# Altium schematic sheet Controller.SchDoc
size A3
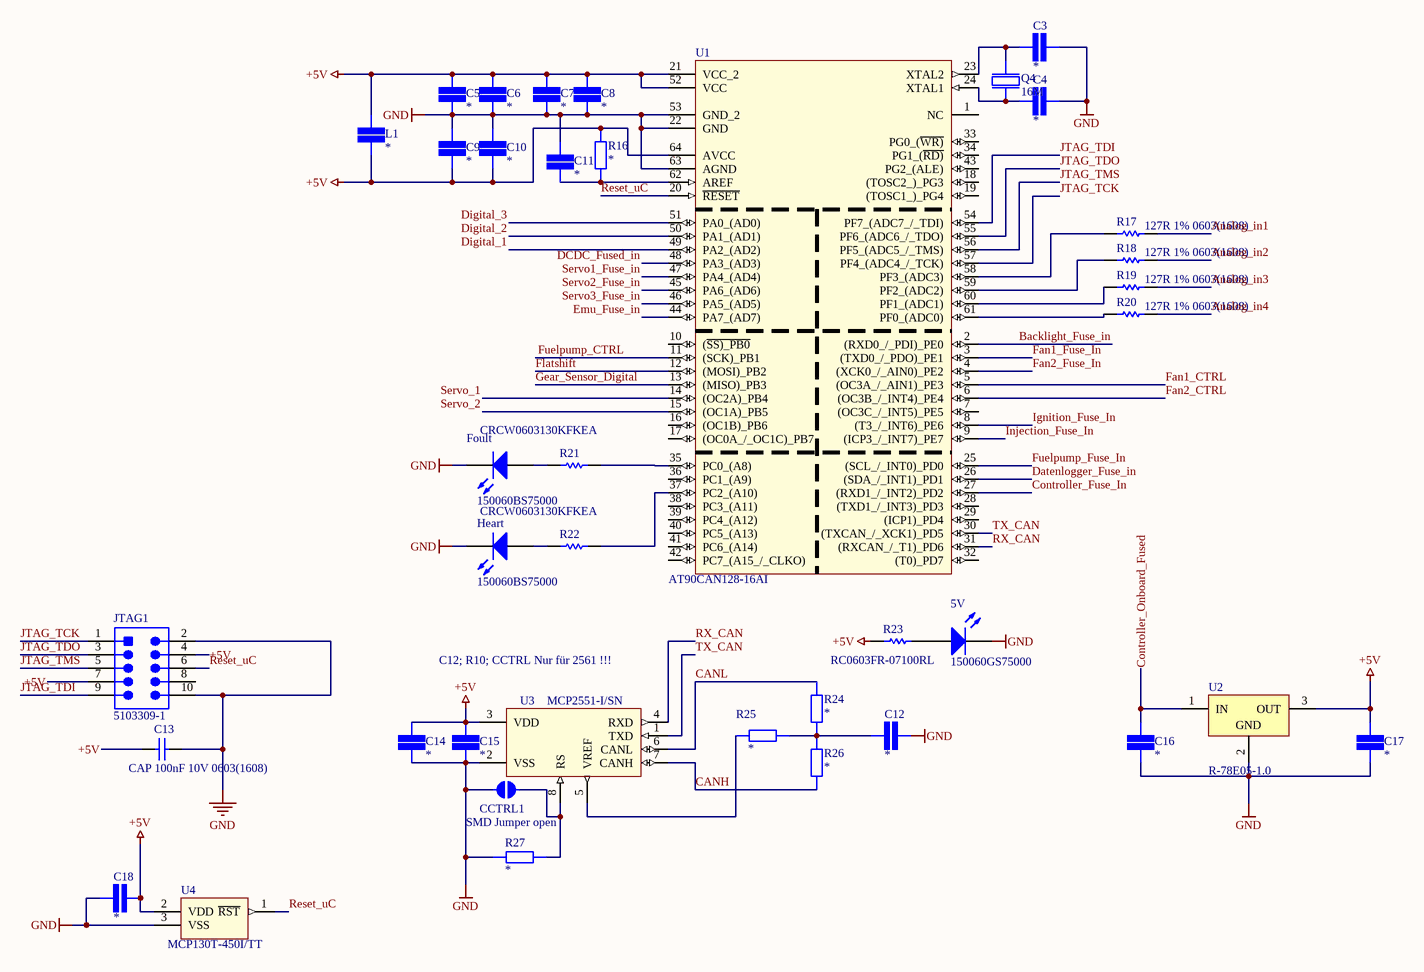
[diagram p0: Controller.SchDoc]

## Parts
5V  150060GS75000  [0603_A]
C3  SMD Capacitor  [CAP 0603/1608]  (value not drawn)
C4  SMD Capacitor  [CAP 0603/1608]  (value not drawn)
C5  SMD Capacitor  [CAP 0603/1608]  (value not drawn)
C6  SMD Capacitor  [CAP 0603/1608]  (value not drawn)
C7  SMD Capacitor  [CAP 0603/1608]  (value not drawn)
C8  SMD Capacitor  [CAP 0603/1608]  (value not drawn)
C9  SMD Capacitor  [CAP 0603/1608]  (value not drawn)
C10  SMD Capacitor  [CAP 0603/1608]  (value not drawn)
C11  SMD Capacitor  [CAP 0603/1608]  (value not drawn)
C12  SMD Capacitor  [CAP 0603/1608]  (value not drawn)
C13  CAP 100nF 10V 0603(1608)  [CAPC0603(1608)100_L]
C14  SMD Capacitor  [CAP 0603/1608]  (value not drawn)
C15  SMD Capacitor  [CAP 0603/1608]  (value not drawn)
C16  SMD Capacitor  [CAP 0603/1608]  (value not drawn)
C17  SMD Capacitor  [CAP 0603/1608]  (value not drawn)
C18  SMD Capacitor  [CAP 0603/1608]  (value not drawn)
CCTRL1  SMD Jumper open  [SMD-JUMPER-OPEN]  (no BOM)
Foult  150060BS75000  [0603_A]
Heart  150060BS75000  [0603_A]
JTAG1  5103309-1  [TECO-5103309-1_V]
L1  SMD Capacitor  [CAP 0603/1608]  (value not drawn)
Q4  16M  [NDK NX5032GA]
R16  SMD Resistor  [STACKPOLE CSR0603]  (value not drawn)
R17  127R 1% 0603(1608)  [RESC0603(1608)_N]
R18  127R 1% 0603(1608)  [RESC0603(1608)_N]
R19  127R 1% 0603(1608)  [RESC0603(1608)_N]
R20  127R 1% 0603(1608)  [RESC0603(1608)_N]
R21  CRCW0603130KFKEA  [RESC1609X50X30NL10T20]
R22  CRCW0603130KFKEA  [RESC1609X50X30NL10T20]
R23  RC0603FR-07100RL  [RESC1608X55X25ML10T15]
R24  SMD Resistor  [STACKPOLE CSR0603]  (value not drawn)
R25  SMD Resistor  [STACKPOLE CSR0603]  (value not drawn)
R26  SMD Resistor  [STACKPOLE CSR0603]  (value not drawn)
R27  SMD Resistor  [STACKPOLE CSR0603]  (value not drawn)
U1  AT90CAN128-16AI  [*QFP80P1600X1600X120-64N]
U2  R-78E05-1.0  [SIP3_RECOM]
U3  MCP2551-I/SN  [*SOIC127P600X175-8N]
U4  MCP130T-450I/TT  [*SOT95P237X112-3N]

## Nets
+5V: C5.2 C6.2 C7.2 C8.2 C9.1 C10.1 C13.1 C14.2 C15.2 C17.2 C18.1 JTAG1.4 JTAG1.7 L1.1 L1.2 R16.2 R23.1 U1.21(VCC_2) U1.52(VCC) U1.64(AVCC) U2.3(OUT) U3.3(VDD) U4.2(VDD)
GND: 5V.1(K) C3.1 C4.1 C5.1 C6.1 C7.1 C8.1 C9.2 C10.2 C11.2 C12.2 C13.2 C14.1 C15.1 C16.1 C17.1 C18.2 CCTRL1.1 Foult.1(K) Heart.1(K) JTAG1.2 JTAG1.10 R27.1 U1.22(GND) U1.53(GND_2) U1.63(AGND) U2.2(GND) U3.2(VSS) U4.3(VSS)
Analog_in1: R17.1
Analog_in2: R18.1
Analog_in3: R19.1
Analog_in4: R20.1
Backlight_Fuse_in: U1.2((RXD0_/_PDI)_PE0)
CANH: R26.2 U3.7(CANH)
CANL: R24.1 U3.6(CANL)
Controller_Fuse_In: U1.27((RXD1_/_INT2)_PD2)
Controller_Onboard_Fused: C16.2 U2.1(IN)
Datenlogger_Fuse_in: U1.26((SDA_/_INT1)_PD1)
DCDC_Fused_in: U1.48(PA3_(AD3))
Digital_1: U1.49(PA2_(AD2))
Digital_2: U1.50(PA1_(AD1))
Digital_3: U1.51(PA0_(AD0))
Emu_Fuse_in: U1.44(PA7_(AD7))
Fan1_CTRL: U1.5((OC3A_/_AIN1)_PE3)
Fan1_Fuse_In: U1.3((TXD0_/_PDO)_PE1)
Fan2_CTRL: U1.6((OC3B_/_INT4)_PE4)
Fan2_Fuse_In: U1.4((XCK0_/_AIN0)_PE2)
Flatshift: U1.12((MOSI)_PB2)
Fuelpump_CTRL: U1.11((SCK)_PB1)
Fuelpump_Fuse_In: U1.25((SCL_/_INT0)_PD0)
Gear_Sensor_Digital: U1.13((MISO)_PB3)
Ignition_Fuse_In: U1.8((T3_/_INT6)_PE6)
Injection_Fuse_In: U1.9((ICP3_/_INT7)_PE7)
JTAG_TCK: JTAG1.1 U1.57(PF4_(ADC4_/_TCK))
JTAG_TDI: JTAG1.9 U1.54(PF7_(ADC7_/_TDI))
JTAG_TDO: JTAG1.3 U1.55(PF6_(ADC6_/_TDO))
JTAG_TMS: JTAG1.5 U1.56(PF5_(ADC5_/_TMS))
Reset_uC: JTAG1.6 U1.20(~{RESET}) U4.1(~{RST})
RX_CAN: U1.31((RXCAN_/_T1)_PD6) U3.4(RXD)
Servo1_Fuse_in: U1.47(PA4_(AD4))
Servo2_Fuse_in: U1.45(PA6_(AD6))
Servo3_Fuse_in: U1.46(PA5_(AD5))
Servo_1: U1.14((OC2A)_PB4)
Servo_2: U1.15((OC1A)_PB5)
TX_CAN: U1.30((TXCAN_/_XCK1)_PD5) U3.1(TXD)
Net5V_2: 5V.2(A) R23.2
NetC3_2: C3.2 Q4.2 U1.23(XTAL2)
NetC4_2: C4.2 Q4.1 U1.24(XTAL1)
NetC11_1: C11.1 R16.1 U1.62(AREF)
NetC12_1: C12.1 R24.2 R25.2 R26.1
NetCCTRL1_2: CCTRL1.2 R27.2 U3.8(RS)
NetFoult_2: Foult.2(A) R21.2
NetHeart_2: Heart.2(A) R22.2
NetR17_2: R17.2 U1.58(PF3_(ADC3))
NetR18_2: R18.2 U1.59(PF2_(ADC2))
NetR19_2: R19.2 U1.60(PF1_(ADC1))
NetR20_2: R20.2 U1.61(PF0_(ADC0))
NetR21_1: R21.1 U1.35(PC0_(A8))
NetR22_1: R22.1 U1.37(PC2_(A10))
NetR25_1: R25.1 U3.5(VREF)

Not connected (* = marked no-connect by the designer): JTAG1 8; U1 1(NC) 7((OC3C_/_INT5)_PE5) 10((~{SS)_PB0}) 16((OC1B)_PB6) 17((OC0A_/_OC1C)_PB7) 18((TOSC2_)_PG3) 19((TOSC1_)_PG4) 28((TXD1_/_INT3)_PD3) 29((ICP1)_PD4) 32((T0)_PD7) 33(PG0_(~{WR)}) 34(PG1_(~{RD)}) 36(PC1_(A9)) 38(PC3_(A11)) 39(PC4_(A12)) 40(PC5_(A13)) 41(PC6_(A14)) 42(PC7_(A15_/_CLKO)) 43(PG2_(ALE))

## Notes on the sheet
- C12; R10; CCTRL Nur für 2561 !!!

## Library data of the parts
5V = CMP-1426-00002-1: SMD mono-color Chip LED, WL-SMCW, Green; Manufacturer: Wuerth Elektronik; ComponentLink1URL: http://www.we-online.com; ComponentLink2Description: Datasheet; Color: Green; ComponentLink2URL: http://katalog.we-online.com/led/datasheet/150060GS75000.pdf; PartNumber: 150060GS75000; PackageReference: 0603_A; ComponentLink1Description: Manufacturer URL
C3-C12 C14-C18 L1 = SMD Capacitor: Capacitor with multiple Footprints; Value: *
C13 = CMP-1035-02579-1: CAP 100nF 10V ±5% 0603 (1608 Metric) Thickness 1mm SMD; Tolerance: Â±5%; Case-EIA: 0603; Case-Metric: 1608; Value: 100nF; Max Thickness: 1 mm; Rated Voltage: 10 V; Technology: SMT
Foult Heart = CMP-1426-00003-1: SMD mono-color Chip LED, WL-SMCW, Blue; Manufacturer: Wuerth Elektronik; Color: Blue; ComponentLink2Description: Datasheet; ComponentLink2URL: http://katalog.we-online.com/led/datasheet/150060BS75000.pdf; ComponentLink1URL: http://www.we-online.com; PackageReference: 0603_A; PartNumber: 150060BS75000; ComponentLink1Description: Manufacturer URL
JTAG1 = CMP-2000-07502-1: Male Header, Pitch 2.54 mm, 2 x 5 Position, Height 9.855 mm, Tail Length 3.048 mm, -65 to 105 degC, RoHS, Tube; Manufacturer: TE Connectivity; PCB Mounting Orientation: Vertical; Pitch: 2.54mm; Mating Connector Lock: No(Without); Body Material: Thermoplastic; Shrouded: Yes(With); Connector System: Wire-to-Board; Insulation Resistance: 5GR; Number of Positions: 10; Max Current Rating: 1A; PCB Mount Retention: Without; Manufacturer URL: http://www.te.com/; Contact Plating: Gold; Datasheet URL: http://www.te.com/commerce/DocumentDelivery/DDEController?Action=showdoc&DocId=Customer+Drawing%7F5103309%7FE1%7Fpdf%7FEnglish%7FENG_CD_5103309_E1.pdf%7F5103309-1; Colour: Black; Termination: ThroughHole; Housing Colour: Black; Flammability Rating: UL94V-0; Package Description: Male Header, Pitch 2.54 mm, 2 x 5 Position, Height 9.855 mm, Tail Length 3.048 mm; Mating Retention: No(Without); Orientation: Straight; Row Spacing: 2.54mm; Termination Post Length: 0.12inch; Min Operating Temperature: -65degC; Board Standoff: Yes(With); REACH SVHC: NoSVHC; Depth: 9.14mm; Lead Free: LeadFree; Gender: Male; Connector Type: Header; Shrouded End Dimension: 3.81mm; ELV: Compliant; Mating Alignment: Yes(With); Panel Mount Retention: No(Without); Package Quantity: 35; PCB Mount Alignment: No(Without); Number of Rows: 2; Package Reference: 5103309-1; Mounting Technology: ThroughHole; Mount: ThroughHole; Contact Gender: Male; Number of Contacts: 10; Length: 0.8inch; Current Rating: 1A; Contact Mating Length: 0.24inch; Max Operating Temperature: 105degC; RoHSCompliant: True; Datasheet Version: Rev. E1, 03/2011; Contact Shape: Square; Height: 8.813mm; Housing Material: PBT; Contact Material: CopperAlloy; Packaging: Rail/Tube
Q4 = 16 MHz Quartz
R16 R24-R27 = SMD Resistor: Resistor with multiple footprints; Value: *
R17-R20 = CMP-1012-00408-1: 127R 0.1W 1% 0603 (1608 Metric)  SMD; Case-Metric: 1608; Value: 127.00 Ohm; Case-EIA: 0603; Power: 0.1 W; Tolerance: 1 %; Technology: SMT
R21 R22 = CMP-2000-03887-1: Manufacturer: Vishay Dale; Part Number: CRCW0603130KFKEA
R23 = CMP-2100-03663-1: Chip Resistor, 100 Ohm, +/- 1%, 0.1 W, -55 to 155 degC, 0603 (1608 Metric), RoHS, Tape and Reel; Manufacturer: Yageo; Voltage Rating (DC): 50V; Power Rating: 100mW; Resistance: 100Ohm; Temperature Coefficient: 100ppm/degreesC; Number of Pins: 2; Tolerance: 1%; Height: 0.45mm; Manufacturer URL: http://www.yageo.com/; Military Standard: Not; Datasheet URL: http://www.yageo.com/NewPortal/yageodocoutput?fileName=/pdf/R-Chip/PYu-RC_Group_51_RoHS_L_5.pdf; Case Code (Imperial): 0603; Termination: SMD/SMT; Lead Free: LeadFree; Max Operating Temperature: 155degC; Case Code (Metric): 1608; RoHSCompliant: true; Voltage Rating: 50V; Width: 0.8mm; Composition: ThickFilm; Depth: 0.8mm; REACH SVHC: Unknown; Min Operating Temperature: -55degC; Packaging: TapeandReel; Package Description: 2-Pin Surface Mount Device, Body 1.6 x 0.8 mm; Length: 1.6mm; Package Reference: 0603; Datasheet Version: Rev. 5, 10/2016; Case/Package: 0603
U1 = AT90CAN128-16AI: Ic Mcu 8bit 128kb Flash 64tqfp; MF: Microchip; MP: AT90CAN128-16AI; Package: TQFP-64 Microchip; SnapEDA_Link: https://www.snapeda.com/parts/AT90CAN128-16AI/Microchip/view-part/?ref=snap; Price: None; Availability: Unavailable; Value: *
U2 = R-78E05-1.0: Nonisolated 5V Switchmode converter
U3 = MCP2551-I/SN: MCP2551 Series 5.5 V 1 Mb/s Surface Mount High-Speed CAN Transceiver - SOIC-8; MF: Microchip; MP: MCP2551-I/SN; SnapEDA_Link: https://www.snapeda.com/parts/MCP2551-I/SN/Microchip/view-part/?ref=snap; Price: None; Package: SOIC-8 Microchip; Availability: Unavailable; Value: *
U4 = MCP130T-450I/TT: System Supervisors - Power Supply Monitors with Reset Generators Open Drain Low; MF: Microchip; MP: MCP120T-450I/TT; Price: None; SnapEDA_Link: https://www.snapeda.com/parts/MCP120T-450I/TT/Microchip/view-part/?ref=snap; Package: SOT-23-3 Microchip; Availability: Unavailable; Value: *